# EAGLE schematic low_side_driver (EAGLE 8.6.0)
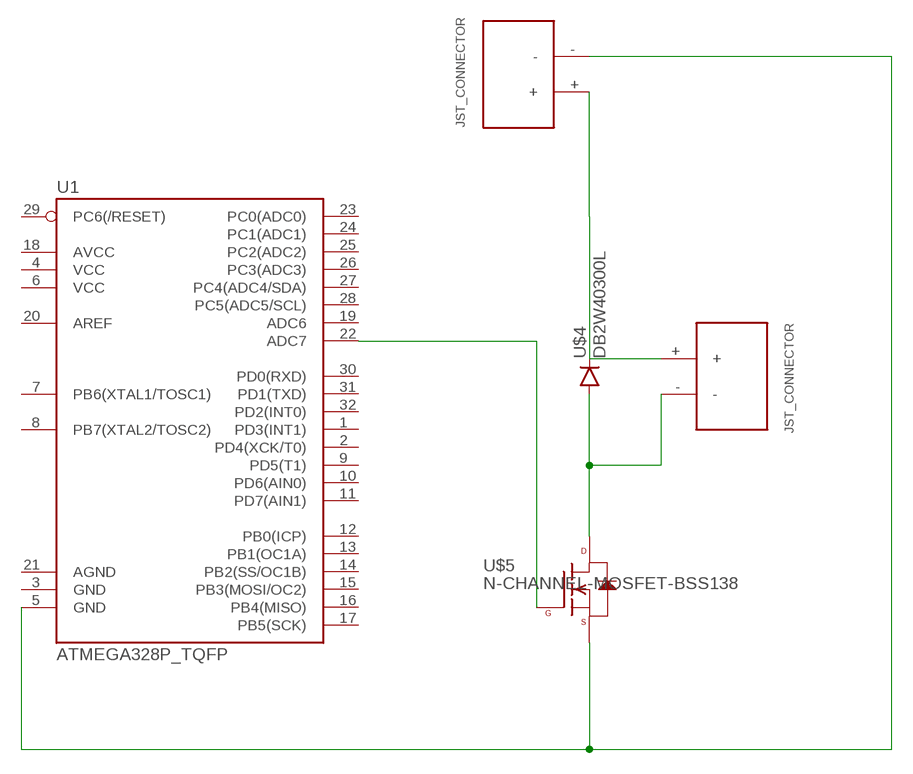
[diagram p0: schematic, sheet 1]

## Parts
U1  ATMEGA328P_TQFP  [TQFP32-08]
U$1  JST_CONNECTOR_FEMALE  [JST_CONNECTOR_FEMALE]
U$3  JST_CONNECTOR_FEMALE  [JST_CONNECTOR_FEMALE]
U$4  DB2W40300L  [MINI2-F3-B]
U$5  N-CHANNEL-MOSFET-BSS138  [SOT23-3]

## Nets
N$1: U1.22(ADC7) U$5.1(G)
N$2: U$3.- U$4.POS(PPIN) U$5.3(D)
N$3: U$1.+ U$3.+ U$4.NEG(GPIN)
N$4: U1.5(GND) U$1.- U$5.2(S)
Unconnected: U1.1(PD3(INT1)) U1.2(PD4(XCK/T0)) U1.3(GND) U1.4(VCC) U1.6(VCC) U1.7(PB6(XTAL1/TOSC1)) U1.8(PB7(XTAL2/TOSC2)) U1.9(PD5(T1)) U1.10(PD6(AIN0)) U1.11(PD7(AIN1)) U1.12(PB0(ICP)) U1.13(PB1(OC1A)) U1.14(PB2(SS/OC1B)) U1.15(PB3(MOSI/OC2)) U1.16(PB4(MISO)) U1.17(PB5(SCK)) U1.18(AVCC) U1.19(ADC6) U1.20(AREF) U1.21(AGND) U1.23(PC0(ADC0)) U1.24(PC1(ADC1)) U1.25(PC2(ADC2)) U1.26(PC3(ADC3)) U1.27(PC4(ADC4/SDA)) U1.28(PC5(ADC5/SCL)) U1.29(PC6(/RESET)) U1.30(PD0(RXD)) U1.31(PD1(TXD)) U1.32(PD2(INT0))

## Library data of the parts
U1 = quad:ATMEGA328P_TQFP; PROD_ID: IC-09069
U$1 U$3 = quad:JST_CONNECTOR_FEMALE
U$4 = quad:DB2W40300L
U$5 = quad:N-CHANNEL-MOSFET: N-Channel MOSFET Mode Field Effect Transistor; DATASHEET: http://www.fairchildsemi.com/ds/BS/BSS138.pdf; DIGIKEY: BSS138TR-ND; ELEMENT14: 2323154; URL: http://au.element14.com/fairchild-semiconductor/bss138/mosfet-n-ch-50v-220ma-sot-23/dp/2323154